# EasyEDA Pro project FFB6.1_EasyEDA_Pro_Document.epro

# Board PCB_Blimp_V6.0
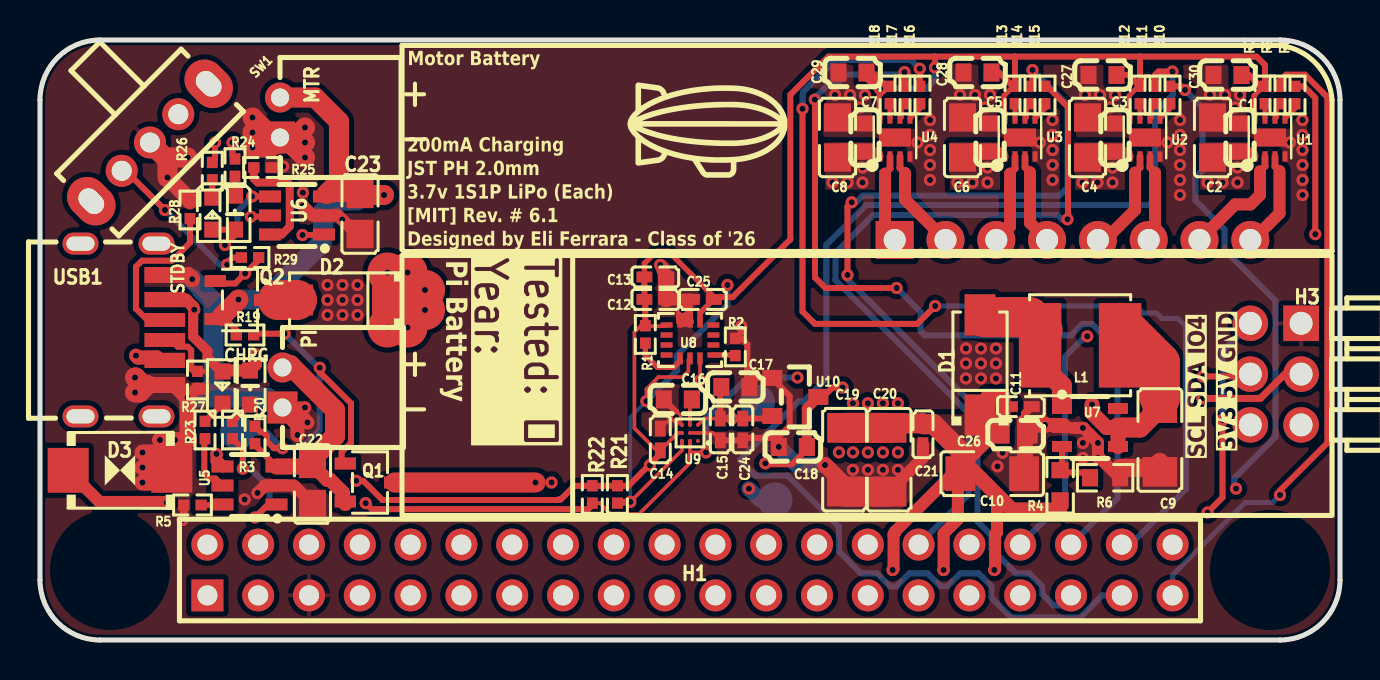
[diagram p0: board, top side]
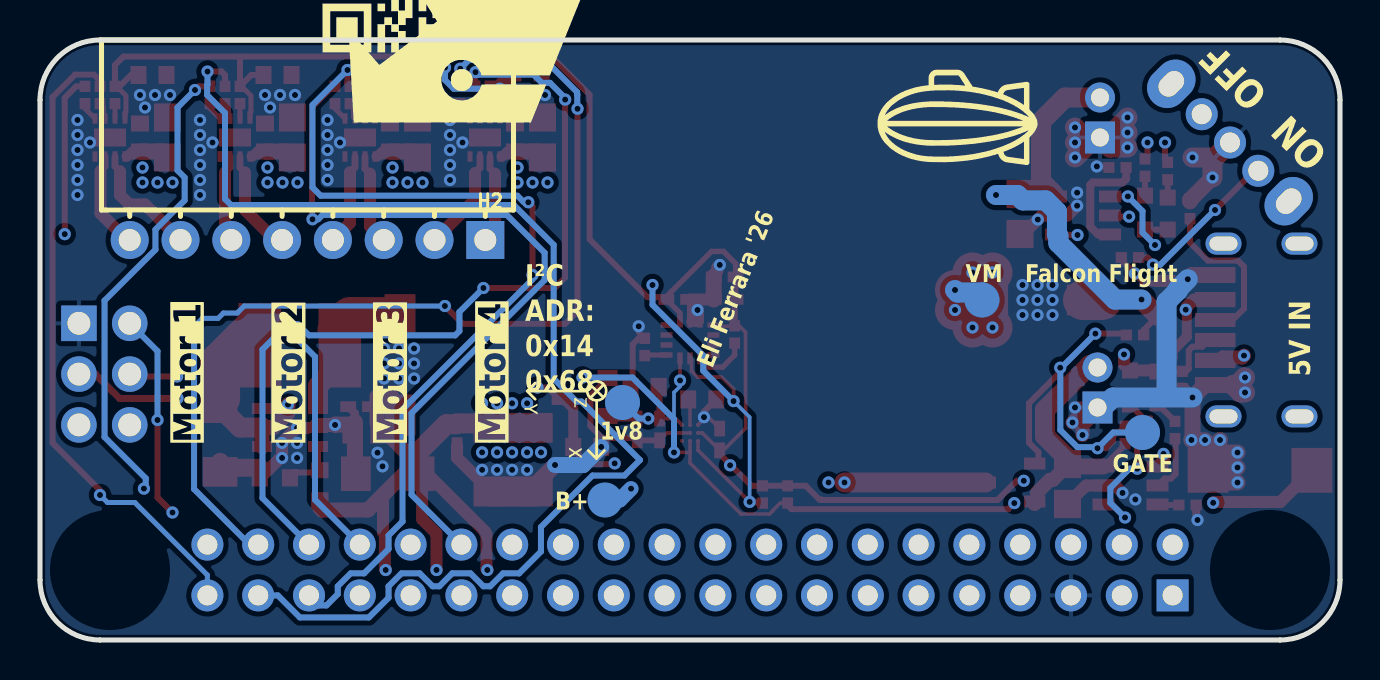
[diagram p1: board, bottom side, seen from below]

Outline 65 x 30 mm; copper layers: Top Layer, Inner1, Inner2, Bottom Layer. Coordinates in mm from the lower left corner of the outline.
Outline path: 0,27 arc(0.88,29.12) 3,30 62,30 arc(64.12,29.12) 65,27 65,3 arc(64.12,0.88) 62,0 3,0 arc(0.88,0.88) 0,3 0,27
Stack: Top Layer 0.035mm Outer layer thickness 1oz / Dielectric1 0.2104mm 7628 RC49% 8.6mil / Inner1 0.0152mm Inner layer thickness / Dielectric2 1.065mm 1.1mm H/HOZ Copper / Inner2 0.0152mm Inner layer thickness / Dielectric3 0.2104mm 7628 RC49% 8.6mil / Bottom Layer 0.035mm Outer layer thickness 1oz

## Design rules (mm)
template: User Custom Config
spacing Default (default): track to track 0.152, other pairs 0 to 0.152
track width Default (default): min 0.2, default 0.25, max 25.4
track width DriverPWR: min 0.35, default 0.75, max 1
track width MotorPWR: min 0.2, default 0.6, max 0.8
differential pair differentialPair (default): width min 0.127, default 0.254, max 2.54; gap min 0.152, default 0.152
via Default (default): diameter min 0.61, default 0.61, max 100.025; hole min 0.305, default 0.305, max 59.995
net 5V uses DriverPWR
net GND uses DirectConnect
net V_MOTOR uses DirectConnect

## Placement (name value [footprint] x y rotation side)
C1  100nF  [C0603]  60 25.12 270 top
C2  22uF  [C0805]  58.62 25.12 270 top
C3  100nF  [C0603]  53.75 25.12 270 top
C4  22uF  [C0805]  52.38 25.12 270 top
C5  100nF  [C0603]  47.5 25.12 270 top
C6  22uF  [C0805]  46.12 25.12 270 top
C7  100nF  [C0603]  41.25 25.12 270 top
C8  22uF  [C0805]  39.88 25.12 270 top
C9  22uF  [C1206]  55.99 10 90 top
C10  22uF  [C1206]  47.61 8.32 180 top
C11  100nF  [C0402]  49.04 11.67 180 top
C12  100nF  [C0402]  30.77 17.03 180 top
C13  100nF  [C0402]  30.77 18.15 180 top
C14  100nF  [C0402]  31.02 10.03 270 top
C15  100nF  [C0402]  34.02 10.53 270 top
C16  2.2uF  [C0603]  31.89 12.03 0 top
C17  2.2uF  [C0603]  34.77 12.65 0 top
C18  2.2uF  [C0603]  37.64 9.65 180 top
C19  100uF  [C1206]  40.23 9.02 270 top
C20  10uF  [C1206]  42.46 9.01 270 top
C21  100nF  [C0402]  44.15 10.29 270 top
C22  10uF  [C0805]  13.62 7.8 90 top
C23  10uF  [C0805]  16 21.3 90 top
C24  10uF  [C0402]  35.14 10.53 90 top
C25  10uF  [C0402]  33.14 17.03 0 top
C26  1uF  [C0603]  48.78 10.27 180 top
C27  100nF  [C0603]  53.12 28.25 180 top
C28  100nF  [C0603]  46.88 28.38 180 top
C29  100nF  [C0603]  40.62 28.38 180 top
C30  100nF  [C0603]  59.38 28.25 180 top
CHRG  RED_0603  [LED0603-R-RD]  10.5 12.62 90 top
CHRG1  RED_0603  [LED0603-R-RD]  9.75 21.37 270 top
D1  SS54  [SMA_L4.4-W2.8-LS5.4-R-RD]  47 13.75 90 top
D2  SS54  [SMA_L4.4-W2.8-LS5.4-R-RD]  15.12 17 180 top
D3  P6SMB6.8CA/TR13  [SMB_L4.6-W3.6-LS5.3-BI]  4 8.48 0 top
H1  Pi Zero Header  [HDR-TH_40P-P2.54-V-F-R2-C20-S2.54]  32.5 3.5 0 top
H2  PM254-1-08-W-8.5  [HDR-TH_8P-P2.54-H-F-W10.0-N]  51.62 20 0 bottom
H3  A2541WR-2x3P  [HDR-TH_6P-P2.54-H-R2-C3-S2.54-W10.0_A2541WR]  61.78 13.3 270 top
L1  6.8uH  [IND-SMD_L5.0-W5.0]  52.01 14.74 0 top
MTR  Battery Connector  [HDR-TH_2P-P2.00-H-F-W6.0]  12 26.12 90 top
NOREF  -  [Pad_e969]  35.88 11.88 0 top
NOREF#2  -  [Pad_e1825]  9.88 10.38 0 top
NOREF#3  -  [Pad_e638]  36.75 7 0 top
NOREF#4  -  [Pad_e3380]  17.9 17 0 top
PI  Battery Connector  [HDR-TH_2P-P2.00-H-F-W6.0]  12.12 12.62 90 top
Q1  DMP2035U-7  [SOT-23-3_L2.9-W1.6-P1.90-LS2.8-BR]  16.5 7.88 180 top
Q2  DMP2035U-7  [SOT-23-3_L2.9-W1.6-P1.90-LS2.8-BR]  10 17 180 top
R1  100kΩ  [R0402]  30.27 15.28 90 top
R2  100kΩ  [R0402]  34.77 14.65 270 top
R3  1kΩ  [R0402]  9.62 10.5 90 top
R4  220kΩ  [R0603]  51.01 7.74 270 top
R5  5.1kΩ  [R0402]  7.62 6.75 180 top
R6  30kΩ  [R0603]  53.26 8.11 180 top
R7  330Ω  [R0402]  62.75 27.25 90 top
R8  330Ω  [R0402]  62 27.25 270 top
R9  10kΩ  [R0402]  61.25 27.25 270 top
R10  330Ω  [R0402]  56.5 27.25 90 top
R11  330Ω  [R0402]  55.75 27.25 270 top
R12  10kΩ  [R0402]  55 27.25 270 top
R13  330Ω  [R0402]  50.25 27.25 90 top
R14  330Ω  [R0402]  49.5 27.25 270 top
R15  10kΩ  [R0402]  48.75 27.25 270 top
R16  330Ω  [R0402]  44 27.25 90 top
R17  330Ω  [R0402]  43.25 27.25 270 top
R18  10kΩ  [R0402]  42.5 27.25 270 top
R19  100kΩ  [R0402]  10.25 15.25 0 top
R20  100kΩ  [R0402]  10.75 10.25 270 top
R21  2.2kΩ  [R0402]  28.87 7.28 90 top
R22  2.2kΩ  [R0402]  27.62 7.28 90 top
R23  10kΩ  [R0402]  8.25 10.5 90 top
R24  1kΩ  [R0402]  9.75 23.62 270 top
R25  5.1kΩ  [R0402]  11.12 23.62 0 top
R26  10kΩ  [R0402]  8.61 23.44 270 top
R27  5.1kΩ  [R0402]  7.88 13 90 top
R28  5.1kΩ  [R0402]  7.5 21.5 270 top
R29  100Ω  [R0402]  10.5 19.12 0 top
STDBY  NCD0603G3  [LED0603-RD]  9.12 12.62 90 top
STDBY1  NCD0603G3  [LED0603-RD]  8.61 21.32 270 top
SW1  SK12D07VG3  [SW-TH_SK12D07VG3]  5.5 24.88 225 top
U1  DRV8212PDSGR  [WSON-8_L2.0-W2.0-P0.50-TL-EP]  61.5 25.12 90 top
U2  DRV8212PDSGR  [WSON-8_L2.0-W2.0-P0.50-TL-EP]  55.25 25.12 90 top
U3  DRV8212PDSGR  [WSON-8_L2.0-W2.0-P0.50-TL-EP]  49 25.12 90 top
U4  DRV8212PDSGR  [WSON-8_L2.0-W2.0-P0.50-TL-EP]  42.75 25.12 90 top
U5  TP4057  [SOT-23-6_L2.9-W1.6-P0.95-LS2.8-BR]  10.47 7.73 0 top
U6  TP4057  [SOT-23-6_L2.9-W1.6-P0.95-LS2.8-BR]  12.85 21.23 0 top
U7  MT3608  [SOT-23-6_L2.9-W1.6-P0.95-LS2.8-BR#2]  52.5 10.62 180 top
U8  BMI270  [LGA-14_L3.0-W2.5-P0.50-BR]  32.5 15 0 top
U9  BMM350  [WLCSP-9_L1.3-W1.3-R3-C3-P0.40-TL]  32.5 10.35 180 top
U10  ME6206A18XG  [SOT-23_L2.9-W1.3-P1.90-LS2.4-BR]  37.77 12.15 180 top
USB1  USB-TYPE-C-6PIN  [USB-C-SMD-6P]  4 15.5 0 top

## Footprints (pads in the part's own frame, mm; a bottom-side part is the same pattern mirrored in y, then rotated)
C0402
  rect 0.79x0.54 smd: 1(-0.545,0) 2(0.545,0)
C0603
  rect 0.8x0.9 smd: 1(-0.7,0) 2(0.7,0)
C0805
  rect 1.41x1.35 smd: 1(-1,0) 2(1,0)
C1206
  rect 1.485x1.728 smd: 1(-1.593,0) 2(1.593,0)
HDR-TH_2P-P2.00-H-F-W6.0
  rect 1.6x1.5 hole 0.9: 1(-1,0)
  round 1.5 hole 0.9: 2(1,0)
HDR-TH_6P-P2.54-H-R2-C3-S2.54-W10.0_A2541WR
  rect 1.778x1.778 hole 1.143: 1(-2.54,1.27)
  round 1.778 hole 1.143: 2(-2.54,-1.27) 3(0,1.27) 4(0,-1.27) 5(2.54,1.27) 6(2.54,-1.27)
HDR-TH_8P-P2.54-H-F-W10.0-N
  rect 1.9x1.9 hole 1.1: 1(-8.89,0)
  round 1.9 hole 1.1: 2(-6.35,0) 3(-3.81,0) 4(-1.27,0) 5(1.27,0) 6(3.81,0) 7(6.35,0) 8(8.89,0)
HDR-TH_40P-P2.54-V-F-R2-C20-S2.54
  rect 1.6x1.6 hole 1: 1(-24.13,-1.27)
  round 1.6 hole 1: 2(-24.13,1.27) 3(-21.59,-1.27) 4(-21.59,1.27) 5(-19.05,-1.27) 6(-19.05,1.27) 7(-16.51,-1.27) 8(-16.51,1.27) 9(-13.97,-1.27) 10(-13.97,1.27) 11(-11.43,-1.27) 12(-11.43,1.27) 13(-8.89,-1.27) 14(-8.89,1.27) 15(-6.35,-1.27) 16(-6.35,1.27) 17(-3.81,-1.27) 18(-3.81,1.27) 19(-1.27,-1.27) 20(-1.27,1.27) 21(1.27,-1.27) 22(1.27,1.27) 23(3.81,-1.27) 24(3.81,1.27) 25(6.35,-1.27) 26(6.35,1.27) 27(8.89,-1.27) 28(8.89,1.27) 29(11.43,-1.27) 30(11.43,1.27) 31(13.97,-1.27) 32(13.97,1.27) 33(16.51,-1.27) 34(16.51,1.27) 35(19.05,-1.27) 36(19.05,1.27) 37(21.59,-1.27) 38(21.59,1.27) 39(24.13,-1.27) 40(24.13,1.27)
IND-SMD_L5.0-W5.0
  rect 2.124x4.22 smd: 1(2,0) 2(-2,0)
LED0603-R-RD
  rect 0.8x0.8 smd: 1(0.851,0) 2(-0.851,0)
LED0603-RD
  rect 0.8x0.8 smd: 1(-0.799,0) 2(0.799,0)
LGA-14_L3.0-W2.5-P0.50-BR
  rect 0.6x0.27 smd: 1(1.17,-0.75) 2(1.17,-0.25) 3(1.17,0.25) 4(1.17,0.75) 8(-1.17,0.75) 9(-1.17,0.25) 10(-1.17,-0.25) 11(-1.17,-0.75)
  rect 0.27x0.6 smd: 5(0.5,0.92) 6(0,0.92) 7(-0.5,0.92) 12(-0.5,-0.92) 13(0,-0.92) 14(0.5,-0.92)
Pad_e638
  round 1.75 smd far side: TP1(0,0)
Pad_e969
  round 1.75 smd far side: TP1(0,0)
Pad_e1825
  round 1.75 smd far side: TP1(0,0)
Pad_e3380
  round 1.75 smd far side: TP1(0,0)
R0402
  rect 0.566x0.54 smd: 1(-0.433,0) 2(0.433,0)
R0603
  rect 0.806x0.864 smd: 1(-0.753,0) 2(0.753,0)
SMA_L4.4-W2.8-LS5.4-R-RD
  rect 2.062x1.539 smd: 1(2.503,0) 2(-2.503,0)
SMB_L4.6-W3.6-LS5.3-BI
  rect 2.047x2.241 smd: 1(-2.591,0) 2(2.591,0)
SOT-23-3_L2.9-W1.6-P1.90-LS2.8-BR
  rect 1.07x0.6 smd: 1(1.235,-0.95) 2(1.235,0.95) 3(-1.235,0)
SOT-23-6_L2.9-W1.6-P0.95-LS2.8-BR
  rect 1.1x0.6 smd: 1(1.35,-0.95) 2(1.35,0) 3(1.35,0.95) 4(-1.35,0.95) 5(-1.35,0) 6(-1.35,-0.95)
SOT-23-6_L2.9-W1.6-P0.95-LS2.8-BR#2
  rect 1x0.55 smd: 1(1.4,-0.95) 2(1.4,0) 3(1.4,0.95) 4(-1.4,0.95) 5(-1.4,0) 6(-1.4,-0.95)
SOT-23_L2.9-W1.3-P1.90-LS2.4-BR
  rect 1x0.8 smd: 1(1.15,-0.95) 2(1.15,0.95) 3(-1.15,0)
SW-TH_SK12D07VG3
  oval 1.6x1.6 hole 1: 1(-2,0) 2(0,0) 3(2,0)
  oval 2x2.6 hole 1x1.4: 4(4.15,0) 5(-4.15,0)
USB-C-SMD-6P
  oval 1.8x1.1 hole 1.401x0.7: 0(-1.975,4.32) 0(-1.975,-4.32) 0(1.825,4.32) 0(1.825,-4.32)
  rect 2.032x0.8 smd: 1(2.241,2.749) 6(2.241,-2.749)
  rect 2.032x0.76 smd: 2(2.241,1.52) 5(2.241,-1.52)
  rect 2.032x0.7 smd: 3(2.241,0.5) 4(2.241,-0.5)
WLCSP-9_L1.3-W1.3-R3-C3-P0.40-TL
  round 0.2 smd: A1(-0.4,0.4) A2(0,0.4) A3(0.4,0.4) B1(-0.4,0) B2(0,0) B3(0.4,0) C1(-0.4,-0.4) C2(0,-0.4) C3(0.4,-0.4)
WSON-8_L2.0-W2.0-P0.50-TL-EP
  rect 0.521x0.25 smd: 1(-0.95,0.75) 2(-0.95,0.25) 3(-0.95,-0.25) 4(-0.95,-0.75) 5(0.95,-0.75) 6(0.95,-0.25) 7(0.95,0.25) 8(0.95,0.75)
  rect 0.9x1.6 smd: 9(0,0)

## Nets
1.8V: C15.1 C17.1 C24.2 NOREF.TP1 U9.C1 U10.2
5V: C10.2 C11.2 C19.1 C20.1 C21.1 C26.2 D1.2 H1.1 H3.3 R4.2
GND: C1.1 C2.1 C3.1 C4.1 C5.1 C6.1 C7.1 C8.1 C9.1 C10.1 C11.1 C12.1 C13.1 C14.1 C15.2 C16.1 C17.2 C18.2 C19.2 C20.2 C21.2 C22.1 C23.1 C24.1 C25.1 C26.1 C27.2 C28.2 C29.2 C30.2 D3.2 H1.5 H3.1 MTR.1 PI.1 R2.1 R5.2 R6.1 R25.2 R27.1 R28.1 SW1.2 U1.4 U1.9 U2.4 U2.9 U3.4 U3.9 U4.4 U4.9 U5.2 U6.2 U7.2 U8.6 U8.7 U9.B1 U9.B2 U9.C3 U10.1 USB1.1 USB1.6
VBUS: CHRG.1 CHRG1.1 D3.1 STDBY.2 STDBY1.2 U5.4 U6.4 USB1.2 USB1.5
1WIRE: H1.8 H3.2
BOOST_IN: C9.2 L1.1 NOREF#3.TP1 Q1.3 U7.4 U7.5
MOTOR1_INPUT0: H1.39 R8.1
MOTOR1_INPUT1: H1.34 R7.2
MOTOR1_PIN0: H2.7 U1.2
MOTOR1_PIN1: H2.8 U1.3
MOTOR2_INPUT0: H1.37 R11.1
MOTOR2_INPUT1: H1.32 R10.2
MOTOR2_PIN0: H2.5 U2.2
MOTOR2_PIN1: H2.6 U2.3
MOTOR3_INPUT0: H1.35 R14.1
MOTOR3_INPUT1: H1.30 R13.2
MOTOR3_PIN0: H2.3 U3.2
MOTOR3_PIN1: H2.4 U3.3
MOTOR4_INPUT0: H1.36 R17.1
MOTOR4_INPUT1: H1.38 R16.2
MOTOR4_PIN0: H2.1 U4.2
MOTOR4_PIN1: H2.2 U4.3
MOTOR_BAT: C23.2 MTR.2 Q2.2 R19.1 U6.3
PI_3V3: C12.2 C13.2 C14.2 C18.1 C25.2 C27.1 C28.1 C29.1 C30.1 H1.2 H3.5 R1.2 R9.1 R12.1 R15.1 R18.1 R21.2 R22.2 U1.8 U2.8 U3.8 U4.8 U8.5 U8.8 U9.B3 U10.3
PI_5V: H1.3
PI_BAT: C22.2 PI.2 Q1.2 R20.2 U5.3
SCL: H1.6 H3.6 R21.1 U8.13 U9.A3
SDA: H1.4 H3.4 R22.1 U8.14 U9.A2
V_MOTOR: C1.2 C2.2 C3.2 C4.2 C5.2 C6.2 C7.2 C8.2 D2.2 NOREF#4.TP1 U1.1 U2.1 U3.1 U4.1
$1N60: R4.1 R6.2 U7.3
$1N63: D1.1 L1.2 U7.1
$1N17709: R1.1 U8.12
$1N17837: R2.2 U8.1
$1N18752: C16.2 U9.C2
$1N47192: R27.2 USB1.4
$1N47193: R28.2 USB1.3
$1N47226: R3.1 U5.1
$1N47230: CHRG.2 R3.2
$1N47298: R23.1 U5.5
$1N47344: R5.1 U5.6
$1N48185: R24.1 U6.1
$1N48187: R26.1 U6.5
$1N48202: R25.1 U6.6
$1N48204: CHRG1.2 R24.2
$1N52678: NOREF#2.TP1 Q1.1 Q2.1 R19.2 R20.1 R29.2
$1N67133: R26.2 STDBY1.1
$1N67173: R23.2 STDBY.1
$1N67180: D2.1 Q2.3
$1N86456: R29.1 SW1.3
$1N88956: R7.1 U1.5
$1N88998: R8.2 U1.6
$1N89483: R11.2 U2.6
$1N89485: R10.1 U2.5
$1N89803: R14.2 U3.6
$1N89805: R13.1 U3.5
$1N90123: R17.2 U4.6
$1N90125: R16.1 U4.5
$1N90197: R9.2 U1.7
$1N90243: R12.2 U2.7
$1N90285: R15.2 U3.7
$1N90327: R18.2 U4.7

Pads without a net: H1 7 9 10 11 12 13 14 15 16 17 18 19 20 21 22 23 24 25 26 27 28 29 31 33 40; SW1 1 4 5; U7 6; U8 2 3 4 9 10 11; U9 A1; USB1 0

## Via types
v1: diameter 0.61, hole 0.305, Top Layer to Bottom Layer, 199 vias

## Routing (per net, layer and track width the routed paths; a pad name or vN(x,y) marks a point on that pad's centre or on a via; arc(x,y) is an arc through that point)
1.8V: length 7.1
  Top Layer w0.181: 34.02,11.07 33.22,11.07 U9.C1
  Top Layer w0.3: C17.1 34.02,12.6 34.02,11.07 v1(34.59,11.07) 36.49,11.07 U10.2
  Bottom Layer w0.3: v1(34.59,11.07) 35.07,11.07 NOREF.TP1
5V: length 37.3
  Top Layer w0.35: H3.3 62.23,13.3 61.02,12.08 58.13,12.08 v1(58.12,12.09)
  Top Layer w0.6: v1(47.72,3.5) 47.76,3.54 47.76,5.29 47.85,5.38 47.85,7.26 ; 45.89,8.57 45.89,6.04 45.18,5.33 45.18,3.51 v1(45.18,3.5) ; 45.89,8.57 42.75,5.42 42.75,5.36 42.68,5.29 42.68,3.55 42.62,3.5 ; 45.89,8.57 45.89,8.69 46.02,8.82
  Top Layer w0.75: 48.15,10.84 48.15,12.17 47.4,12.17 ; 51.01,6.61 50.9,6.5 48.6,6.5 47.85,7.25 46.58,8.52 ; 48.08,10.77 46.58,9.27
  Top Layer w1: C20.1 42.68,10.83 C21.1 44.19,10.79 44.69,10.79 46.02,9.46
  Top Layer w1.5: C19.1 C20.1
  vias: v1(39.95,9.38) v1(40.65,11.84) v1(40.65,9.38) v1(41.4,11.84) v1(41.4,9.38) v1(42.15,11.84) v1(42.15,9.38) v1(42.63,3.5) v1(42.9,11.84) v1(42.9,9.38)
GND: length 90.4
  Top Layer w0.181: 31.02,10.57 31.59,11.14 v1(31.8,11.14) 31.8,11.05 U9.C3 ; C15.2 33.65,10.35 U9.B1 U9.B2
  Top Layer w0.27: U8.6 32.51,15.93 32.51,17.03 ; R2.1 35.07,15.39 v1(35.07,15.69)
  Top Layer w0.3: 35.47,12.89 35.68,13.1 36.58,13.1 ; 35.47,12.89 C17.2 ; 35.47,12.89 35.37,12.99 35.37,14.79 35.07,15.09 R2.1 ; 36.58,13.1 37.48,12.2 37.48,10.7 36.88,10.1 ; 36.58,13.1 U10.1 ; C16.1 31.8,11.42 v1(31.8,11.14) ; R25.2 11.54,23.62 11.49,23.68 v1(12.16,23.68) ; v1(36.94,9.65) 36.88,9.71 36.88,10.1 ; 36.88,10.1 35.26,10.1 C24.1 C15.2
  Top Layer w0.4: R5.2 7.19,6.07 v1(7.12,6) ; 49.25,10.9 49.25,11.33 C11.1 ; U8.6 U8.7 ; 12.5,24.88 12.25,25.12
  Top Layer w0.6: C21.2 44.15,9.11 C20.2 ; 8.12,12.57 7.82,12.57 v1(7.38,12.12) ; 51.62,10.6 v1(52.15,10.6) 52.18,10.6 52.9,9.88 52.9,9.19 53.87,8.22 ; v1(31.01,18.75) 31.14,18.63 31.14,18.45 31.31,18.28 31.31,18.15 ; C23.1 15.83,20.3 14.91,21.23 13.63,21.23 v1(13.14,21.71) ; 12.62,11.62 v1(13.25,11.62) ; v1(10.88,7.35) 11.25,7.73 U5.2 12.68,7.73 12.76,7.64 12.78,7.64 C22.1 ; 31.31,17.03 32.51,17.03
  Top Layer w0.7: v1(12.88,10.25) 12.88,10.75 12.15,11.47 ; v1(13.38,10.88) 12.62,11.62 ; 51.17,10.75 v1(50.25,10.75)
  Top Layer w0.8: 49.2,8.82 49.25,8.87 49.25,10.9 ; v1(7.61,18.04) 7.4,18.25 USB1.1 ; v1(39.25,8.75) 40.23,7.77 40.23,7.42 ; v1(5.12,7.88) 5.99,7.88 6.59,8.47 6.59,9.41 v1(6,10) ; 6.75,9.99 7.43,9.99 ; v1(5.12,8.62) 6.44,8.62 5.69,9.38 v1(5.12,9.38) ; R28.1 7.5,22 v1(6.38,23.12) ; 49.48,10.77 50.23,10.77 v1(50.25,10.75) ; 31.31,18.15 31.31,17.03 ; v1(7.43,10) 7.38,10.05 v1(7.38,12.12) 6.75,12.75 USB1.6 ; 32.2,16.5 32.2,16.05
  Top Layer w0.9: 54.01,8.61 55.7,8.61 55.99,8.91
  Top Layer w1: v1(13.25,24.88) 12.5,24.88 v1(13.25,24.12) ; MTR.1 11.5,24.62 v1(10.62,24.62) ; v1(4.75,12.38) 4.97,12.38 5.35,12.75 5.15,12.75 4.78,13.12 v1(4.75,13.12) ; v1(10.62,25.38) 11.38,25.38 v1(10.62,26.12) ; 6.25,24.12 SW1.2 ; 6.25,24.12 v1(7.38,24.12) ; 6.25,24.12 6.38,24 v1(6.38,23.12) ; v1(13.25,25.62) 12.75,25.12 12.25,25.12
  Top Layer w1.5: C20.2 40.23,7.42
  Bottom Layer w0.3: 12,11.62 12,11.48
  Bottom Layer w0.8: v1(39.25,8.75) 37.84,8.75 v1(36.94,9.65)
  Bottom Layer w1: 12,11.48 11.35,12.12 v1(7.38,12.12) ; v1(7.61,18.04) 8.11,17.54 8.11,17.47 8.67,16.91 8.67,12.2
  vias: v1(6.75,10) v1(10.23,7.03) v1(13.14,22.37) v1(14.38,17.75) v1(14.38,17) v1(14.38,16.25) v1(15.11,21.02) v1(15.12,17.75) v1(15.12,17) v1(15.12,16.25) v1(15.88,17.75) v1(15.88,17) v1(15.88,16.25) v1(32.12,16.5) v1(39.75,27.25) v1(40.5,27.25) v1(40.65,8.51) v1(41,26.62) v1(41.25,27.25) v1(41.4,8.51) v1(42.15,8.51) v1(42.9,8.51) v1(43.88,24.88) v1(44.5,26) v1(44.5,25.25) v1(44.5,24.5) v1(44.5,23.75) v1(44.5,23) v1(46,27.25) v1(46.3,14.58) v1(46.3,13.83) v1(46.3,13.08) v1(46.75,27.25) v1(47.05,14.58) v1(47.05,13.83) v1(47.05,13.08) v1(47.25,26.62) v1(47.5,27.25) v1(47.8,14.58) v1(47.8,13.83) v1(47.8,13.08) v1(47.88,8.68) v1(48.12,9.36) v1(50,24.88) v1(50.62,26) v1(50.62,25.25) v1(50.62,24.5) v1(50.62,23.75) v1(50.62,23) v1(52.15,9.85) v1(52.15,9.1) v1(52.25,27.25) v1(52.9,9.85) v1(52.9,9.1) v1(53,27.25) v1(53.5,26.62) v1(53.75,27.25) v1(56.38,24.88) v1(57,26) v1(57,25.25) v1(57,24.5) v1(57,23.75) v1(57,23) v1(57,22.25) v1(58.5,27.25) v1(59.25,27.25) v1(59.75,26.62) v1(60,27.25) v1(62.5,24.88) v1(63.12,26) v1(63.12,25.25) v1(63.12,24.5) v1(63.12,23.75) v1(63.12,23) v1(63.12,22.25)
VBUS: length 39.9
  Top Layer w0.3: STDBY1.2 9.75,20.52 CHRG1.1 9.75,20.25 v1(9.25,19.75) ; v1(10.61,22.18) 11.5,22.18 U6.4
  Top Layer w0.5: 7.66,16.57 7.66,16.62 ; 7.66,16.57 7.66,15.17 8.38,14.45 8.38,14.11 9.06,13.42 STDBY.2 ; 7.66,16.57 v1(7.71,16.52)
  Top Layer w0.6: U5.4 8.82,8.98 v1(8.82,9.3) ; v1(6.34,6.86) 6.3,6.9 2.98,6.9 1.41,8.47 ; STDBY.2 9.18,13.48 CHRG.1 10.8,13.78 v1(10.8,14.28) ; 7.66,16.62 7.66,16.66 7.3,17.02 USB1.2
  Top Layer w0.7: 5.88,14.1 5.84,14.13 4.89,14.13 v1(4.8,14.22)
  Inner2 w0.4: v1(7.71,16.52) 8.5,17.3 8.5,17.38 8.7,17.58 8.7,19.2 v1(9.25,19.75)
  Inner2 w0.9: v1(10.8,14.28) 10.5,13.98 9,13.98
  Inner2 w1: v1(4.8,14.22) 8.76,14.22 9.3,13.68 9.3,9.78 v1(8.82,9.3) 8.79,9.3 v1(6.34,6.86)
  Bottom Layer w0.3: v1(10.61,22.18) 9.88,21.45 9.88,20.38 v1(9.25,19.75)
1WIRE: length 57.6
  Top Layer w0.3: v1(59.12,11) 59.12,7.12 v1(58.38,6.38)
  Inner2 w0.35: H1.8 16.94,4.77 18.06,3.64 19,3.64 19.94,4.59 19.94,5.24 20.6,5.9 44.85,5.9 45.34,5.41 45.34,4.3 46,3.64 46.94,3.64 47.6,4.3 47.6,4.95 49.02,6.38 v1(58.38,6.38)
  Bottom Layer w0.3: H3.2 59.12,14.44 v1(59.12,11)
BOOST_IN: length 49.4
  Top Layer w0.75: U7.4 U7.5 53.33,10.62 52.6,11.36 v1(52.6,11.77)
  Top Layer w1: v1(24.78,7.88) Q1.3 ; 55.99,11.62 55,10.62 U7.5
  Top Layer w2: 55.99,12.09 55.99,13.87 54.01,15.86
  Inner2 w1: 30.13,7.65 30.21,7.57 v1(35.45,7.57) 40.23,7.57 40.25,7.55 43.29,7.55 43.31,7.57 48.4,7.57 49.29,8.45 49.29,11.15 49.85,11.71 50.64,11.71 50.65,11.7 52.53,11.7 ; 29.98,7.8 29.9,7.88 v1(25.57,7.88) v1(24.78,7.88)
  Bottom Layer w0.75: 36.5,7 36.01,7 v1(35.45,7.57)
MOTOR1_INPUT0: length 32.2
  Top Layer w0.3: v1(62,7.25) 62,7.48 64.37,9.85 64.37,27.14 63.25,28.27 62.3,28.27 62,27.97 R8.1
  Bottom Layer w0.25: v1(62,7.25) 61.62,6.88 60.26,6.88 56.63,3.25 H1.39
MOTOR1_INPUT1: length 34.3
  Top Layer w0.3: v1(63.76,20.29) 63.76,27.11 63.19,27.68 R7.2
  Inner2 w0.3: v1(63.76,20.29) 61.97,18.5 54.17,18.5 52.64,16.97 52.64,15.46 v1(52.36,15.18)
  Bottom Layer w0.3: H1.34 51.25,7.01 51.25,14.17 52.27,15.18 v1(52.36,15.18)
MOTOR1_PIN0: length 6
  Top Layer w0.345: 61,23.44 61.25,23.69 61.25,24.17
  Top Layer w0.6: 61,23.44 61,22.25 60.53,21.78 59.75,21.78 H2.7
MOTOR1_PIN1: length 4.9
  Top Layer w0.345: 61.97,23.45 61.75,23.68 U1.3
  Top Layer w0.6: H2.8 60.64,20 61.97,21.33 61.97,23.45
MOTOR2_INPUT0: length 63.3
  Top Layer w0.3: R11.1 55.75,28.25 55.92,28.42 v1(56.62,28.42)
  Bottom Layer w0.3: v1(56.62,28.42) 56.62,27.77 56.64,27.75 56.64,27.25 55.75,26.36 55.75,22.05 55.45,21.75 41.31,21.75 39.32,19.76 39.32,13.07 38.17,11.92 37.93,11.92 35,9 35.77,8.22 37.38,8.22 39.95,5.65 39.95,4.42 41.04,3.33 41.85,3.33 42.49,2.69 42.83,2.69 43.47,3.33 44.39,3.33 45.03,2.69 45.37,2.69 46.01,3.33 46.93,3.33 47.57,2.69 47.57,2.11 48.55,1.13 52.01,1.13 53.11,2.23 H1.37
MOTOR2_INPUT1: length 38.9
  Top Layer w0.3: v1(57.25,27.5) 57.07,27.68 R10.2
  Inner2 w0.3: H1.32 46.74,4.77 50.29,8.32 59.05,8.32 v1(59.8,7.57)
  Bottom Layer w0.3: v1(59.8,7.57) 59.71,7.66 59.71,8.09 61.77,10.15 61.77,16.97 59.23,19.52 59.23,20.52 57.77,21.98 57.77,23.13 58.12,23.48 58.12,26.62 v1(57.25,27.5)
MOTOR2_PIN0: length 5.3
  Top Layer w0.345: U2.2 55,23.62 54.75,23.38
  Top Layer w0.6: H2.5 53.25,20 54.75,21.5 54.75,23.38
MOTOR2_PIN1: length 4.4
  Top Layer w0.345: U2.3 55.5,23.62 55.75,23.38
  Top Layer w0.6: 55.75,23.38 55.75,20.31 H2.6
MOTOR3_INPUT0: length 44.6
  Top Layer w0.3: v1(49.62,28.5) 49.62,27.81 R14.1 ; v1(40.38,18.25) 40.38,21.68 v1(40.59,21.89)
  Bottom Layer w0.3: H1.35 51.05,1.73 50.68,1.73 50.11,2.29 50.11,2.69 49.47,3.33 48.79,3.33 47.57,4.55 47.57,5.23 46.88,5.92 46.88,11.53 40.38,18.03 v1(40.38,18.25) ; v1(40.59,21.89) 40.8,21.89 41.13,22.22 50.97,22.22 51.38,22.62 51.38,26.75 v1(49.62,28.5)
MOTOR3_INPUT1: length 38.1
  Top Layer w0.3: R13.2 50.36,27.68 51.4,26.65 51.4,21.06 v1(51.38,21.04)
  Bottom Layer w0.3: H1.30 46.42,7.26 46.42,11.34 39.77,18 39.77,19.36 41.66,21.25 50.87,21.25 51.09,21.04 v1(51.38,21.04)
MOTOR3_PIN0: length 4.6
  Top Layer w0.345: 48.5,23.32 48.75,23.57 U3.2
  Top Layer w0.6: 48.5,23.32 48.5,20.69 H2.3
MOTOR3_PIN1: length 4.6
  Top Layer w0.345: U3.3 49.25,23.64 49.5,23.39
  Top Layer w0.6: 49.5,23.39 49.5,20.86 H2.4
MOTOR4_INPUT0: length 43.3
  Top Layer w0.3: v1(38.74,27.02) 38.74,27.1 38.75,27.11 38.75,18.12 39.27,17.6 v1(42.83,17.6) ; v1(43.23,28.39) 43.25,28.37 R17.1
  Bottom Layer w0.3: v1(42.83,17.6) 44.03,16.4 44.03,15.44 44.24,15.23 51.55,15.23 52.11,15.79 52.61,15.79 53.88,14.53 53.88,7.09 H1.36 ; v1(43.23,28.39) 43.1,28.27 40.32,28.27 39.91,27.86 39.5,27.86 38.74,27.1 v1(38.74,27.02)
MOTOR4_INPUT1: length 51.3
  Top Layer w0.3: v1(44.76,16.7) 43.86,15.81 38.75,15.81 38.12,16.43 38.12,26.56 ; R16.2 44,28.55 v1(43.99,28.56)
  Bottom Layer w0.25: 57.3,15.67 56.88,16.08 56.09,16.08 55.83,16.35 55.14,16.35 54.79,16.7 v1(44.76,16.7)
  Bottom Layer w0.3: 57.3,15.67 57.3,7.55 54.52,4.77 H1.38 ; v1(43.99,28.56) 43.55,29 39.75,29 38.14,27.39 38.14,27.28 38.14,27.27 38.14,26.77 38.12,26.76 v1(38.12,26.56)
MOTOR4_PIN0: length 4.5
  Top Layer w0.345: U4.2 42.5,23.57 42.25,23.32
  Top Layer w0.6: H2.1 42.25,20.48 42.25,23.32
MOTOR4_PIN1: length 5.1
  Top Layer w0.345: U4.3 43,23.6 43.25,23.35
  Top Layer w0.6: 43.25,23.35 43.25,22.03 H2.2
MOTOR_BAT: length 23.2
  Top Layer w0.3: R19.1 9.82,15.5 9.26,16.05 Q2.2
  Top Layer w0.8: C23.2 14.32,22.3
  Top Layer w1: MTR.2 13.75,27.12 14.95,25.93 14.95,22.92 14.32,22.3 ; C23.2 16.05,22.25 v1(17.2,22.25) ; 9.11,16.21 v1(9.92,17.02)
  Bottom Layer w1: v1(9.92,17.02) 11.25,17.02 14.08,19.85 14.08,20.21 14.15,20.28 14.15,21.42 14.71,21.98 15.85,21.98 16.12,22.25 v1(17.2,22.25)
PI_3V3: length 140.6
  Top Layer w0.181: U9.B3 31.89,10.35 C14.2 ; 30.92,9.39 29.72,10.59 29.72,15.39 30.02,15.69 31.27,15.69 U8.8 ; 30.5,8.79 v1(30.5,8.74)
  Top Layer w0.25: U3.8 48.25,26.37 48.2,26.42 48.2,27.22 48.67,27.68 ; 61.17,27.68 60.7,27.22 60.7,26.42 60.75,26.37 U1.8 ; 42.18,27.45 41.95,27.21 41.95,26.42 42,26.37 U4.8 ; U2.8 54.5,26.37 54.45,26.42 54.45,27.22 54.92,27.68 R12.1
  Top Layer w0.27: 30.32,15.69 R1.2 ; U8.5 33,16.35 33.68,17.03 C25.2 33.69,17.16 31.42,19.43 30.82,19.43 30.22,18.83 C13.2
  Top Layer w0.3: R1.2 30.27,16.98 C12.2 C13.2 ; C25.2 33.8,17.14 34.63,17.14 37.52,20.03 37.52,27.27 39.42,29.17 44.74,29.17 ; v1(40.12,12.62) 39.62,12.62 39.12,12.12 ; C28.1 47.95,28.38 48.64,27.68 R15.1 48.75,29.16 48.74,29.17 ; v1(36.27,8.83) 36.28,8.83 36.32,8.79 37.6,8.79 38.34,9.53 C18.1 ; 44.74,29.17 48.74,29.17 ; 44.74,29.17 44.75,29.16 v1(44.75,28.62) ; 48.74,29.17 55.01,29.17 ; 55.01,29.17 55,29.17 R12.1 54.43,28.25 C27.1 ; 55.01,29.17 60.83,29.17 61.25,28.75 R9.1 61.02,27.68 60.45,28.25 C30.1 ; C14.2 30.92,9.39 30.92,9.21 29.42,7.71 26.72,7.71 26.03,7.02 25.92,7.02 25.9,7 17.12,7 16.16,7.96 v1(15.81,7.96) ; 42.18,27.45 42.06,27.57
  Top Layer w0.5: U10.3 38.34,11.58 C18.1
  Top Layer w0.7: 42.01,27.63 42.01,27.69 C29.1
  Inner2 w0.3: H1.2 8.37,6.62 9.71,7.96 v1(15.81,7.96) ; H3.5 62.2,10.75 61.01,9.56 55.8,9.56 52.85,12.51 49.12,12.51 48.86,12.25 43.46,12.25 43.2,12.51 40.24,12.51 v1(40.12,12.62) ; v1(30.5,8.74) 36,8.74 36.09,8.83 v1(36.27,8.83)
  Bottom Layer w0.3: v1(44.75,28.62) 44.75,28 44.32,27.57 v1(42.01,27.57)
PI_BAT: length 13.1
  Top Layer w0.3: C22.2 13.47,8.8 ; R20.2 10.75,9.75 U5.3
  Top Layer w0.7: 15.26,6.8 15.14,6.92 15.14,7.38 14.51,8.01 14.36,8.01 13.62,8.74 C22.2
  Top Layer w0.8: 13.35,8.8 13.23,8.68 U5.3
  Top Layer w1: 12,13.62 12.12,13.75 12.5,13.75 14.75,11.5 14.75,10.2 13.35,8.8
SCL: length 67.8
  Top Layer w0.181: v1(29.52,6.91) 32.1,9.49 U9.A3 ; v1(30.32,11.94) 30.32,12.55 30.92,13.14 32.12,13.14 32.42,13.44 32.42,14 U8.13
  Top Layer w0.3: 29.12,6.84 29.18,6.91 v1(29.52,6.91)
  Inner2 w0.3: H1.6 14.92,6.24 18.24,6.24 18.91,6.91 v1(29.52,6.91) ; H3.6 60.51,11.11 59,12.62 59,13.49 58.03,14.45 52.24,14.45 50.69,16 37.51,16 35.91,17.61 34.52,17.61 v1(34.38,17.75)
  Bottom Layer w0.181: v1(30.32,11.94) 29.52,11.14 v1(29.52,6.91)
  Bottom Layer w0.3: v1(34.38,17.75) 34.38,16.76 31.84,14.22 31.84,13.46 v1(30.32,11.94)
SDA: length 60.7
  Top Layer w0.181: 32.5,9.38 v1(33.3,9.38) ; 32.5,9.38 32.5,8.85 29.95,6.3 28.52,6.3 28.36,6.46 28.36,6.48 27.99,6.84 27.87,6.84 ; 32.5,9.38 U9.A2 ; v1(33,12.98) U8.14
  Top Layer w0.3: 27.72,6.84 27.42,6.55 16.59,6.55 v1(16.29,6.84) ; v1(58.14,13.18) 60,13.18 60.19,13.37 60.27,13.3 H3.4
  Inner2 w0.3: H1.4 12.99,6.84 v1(16.29,6.84) ; v1(58.14,13.18) 57.32,14 51.88,14 50.33,15.55 40.3,15.55 v1(37.88,13.12)
  Bottom Layer w0.181: 33.3,11.05 33.3,12.38 33,12.68 v1(33,12.98)
  Bottom Layer w0.3: v1(33.3,9.38) 33.3,11.05 35.38,13.12 v1(37.88,13.12)
V_MOTOR: length 15.5
  Top Layer w0.5: 41.93,24.17 41.88,24.17 41.63,24.42 C7.2 ; 48.18,24.17 48.13,24.17 47.88,24.42 C5.2 ; 54.43,24.17 54.38,24.17 54.13,24.42 C3.2 ; 60.68,24.17 60.63,24.17 60.38,24.42 C1.2
  Top Layer w0.8: C1.2 58.93,24.42 C2.2 ; C8.2 40.18,24.42 C7.2 ; C4.2 52.68,24.42 C3.2 ; C6.2 46.43,24.42 C5.2
  Top Layer w2: 18.19,17 18.75,17 v1(19.25,17.5) ; v1(19.25,16.5) 19,16.75 19,16.88 ; 17.94,16.19 v1(17.38,15.62) ; v1(18.38,18.38) 17.94,17.94 17.94,17.81 v1(17.38,18.38) ; 18.07,15.93 v1(18.38,15.62)
  Bottom Layer w1: v1(19.25,17.5) 19.12,17.38 17.88,17.38 17.88,17.03 NOREF#4.TP1
  vias: v1(39.62,22.88) v1(40.38,22.88) v1(41.12,23.62) v1(41.12,22.88) v1(45.88,22.88) v1(46.62,22.88) v1(47.38,23.62) v1(47.38,22.88) v1(52.12,22.88) v1(52.88,22.88) v1(53.62,23.62) v1(53.62,22.88) v1(58.38,22.88) v1(59.12,22.88) v1(59.88,23.62) v1(59.88,22.88)
$1N60: length 2.7
  Top Layer w0.3: 51.1,9.8 51.1,8.71 51.01,8.61 51.01,8.38 52.26,8.38
$1N63: length 6.9
  Top Layer w1: 50.51,15.36 50.51,13.29 51.1,12.7 51.1,11.88
  Top Layer w2: 50.13,15.49 49.48,16.14 47.24,16.14
$1N17709: length 2.8
  Top Layer w0.27: U8.12 32,13.94 31.7,13.64 30.87,13.64 30.27,14.25 R1.1
$1N17837: length 1.1
  Top Layer w0.27: U8.1 34.74,14.25 R2.2
$1N18752: length 1.3
  Top Layer w0.181: U9.C2 32.5,11.94 32.59,12.03
$1N47192: length 3.1
  Top Layer w0.3: 8.12,13.43 7.69,13.43 7.56,13.57 7.56,14.48 7.38,14.66 6.9,14.66 6.56,15 USB1.4
$1N47193: length 8.2
  Top Layer w0.3: USB1.3 5.37,16 4.8,16.57 4.8,18.67 5.1,18.97 6.6,18.97 7.5,19.87 R28.2
$1N47226: length 6.6
  Top Layer w0.3: R3.1 10.14,9.55 v1(10.14,8.57) ; v1(10.75,6.12) 11.4,6.78 U5.1
  Bottom Layer w0.3: v1(10.75,6.12) 11.48,6.86 11.48,7.61 10.52,8.57 v1(10.14,8.57)
$1N47230: length 1.2
  Top Layer w0.3: R3.2 9.66,10.93 CHRG.2
$1N47298: length 2.9
  Top Layer w0.3: U5.5 8.78,8.07 8.45,8.07 8.22,8.31 8.22,10.03 R23.1
$1N47344: length 1.2
  Top Layer w0.3: U5.6 9.1,6.75 7.93,6.75
$1N48185: length 8
  Top Layer w0.3: 9.75,24.12 9.62,24.25 v1(9.62,24.88) ; v1(13.12,20.25) 14.17,20.25 14.2,20.28
  Inner2 w0.3: v1(13.12,20.25) 13.12,20.62 9.62,24.12 v1(9.62,24.88)
$1N48187: length 6.5
  Top Layer w0.3: U6.5 11.44,21.17 v1(10.54,21.17) ; v1(8.75,24.88) 8.75,24 8.62,23.88
  Inner2 w0.3: v1(8.75,24.88) 8.75,22.96 v1(10.54,21.17)
$1N48202: length 5.7
  Top Layer w0.4: R25.1 10.69,23.06 10.88,22.88 12.36,22.88 12.49,22.75 12.49,20.68 12.09,20.28 U6.6
$1N48204: length 1
  Top Layer w0.3: 9.75,23.19 CHRG1.2
$1N52678: length 26.3
  Top Layer w0.3: R20.1 11.03,10.4 11.15,10.4 11.35,10.2 11.35,9.93 11.7,9.59 v1(12.12,9.59) ; Q1.1 15.08,9.01 15.08,9.4 15.55,9.87 15.55,11.83 13.99,13.39 v1(13.99,13.61) ; 15.33,8.76 15.26,8.7 ; R29.2 10.93,19 v1(10.26,18.32) 9.76,17.83 9.26,17.83 9.14,17.95 9.01,17.95 ; v1(12.23,15.32) 10.75,15.32 R19.2
  Inner2 w0.3: v1(10.26,18.32) 10.91,18.32 12.38,16.86 12.38,15.46 v1(12.23,15.32)
  Bottom Layer w0.3: v1(12.23,15.32) 13.94,13.61 v1(13.99,13.61) 13.98,13.61 13.98,10.5 13.13,9.64 12.18,9.64 v1(12.12,9.59) 11.34,10.38 10.25,10.38
$1N67133: length 0.9
  Top Layer w0.3: R26.2 STDBY1.1
$1N67173: length 1.3
  Top Layer w0.3: STDBY.1 9.12,11.81 R23.2
$1N67180: length 0.9
  Top Layer w2: 12.85,17 11.9,17
$1N86456: length 8.1
  Top Layer w0.3: v1(6.25,21.5) 4.29,23.46 SW1.3 ; R29.1 9.62,19.12 9.38,18.88 9.25,18.88
  Bottom Layer w0.3: v1(9.36,18.77) 8.98,18.77 v1(6.25,21.5)
$1N88956: length 0.9
  Top Layer w0.25: R7.1 62.75,26.58 U1.5
$1N88998: length 0.8
  Top Layer w0.25: U1.6 61.82,26.15 61.82,26.64 R8.2
$1N89483: length 0.8
  Top Layer w0.25: U2.6 55.57,26.15 55.57,26.64 R11.2
$1N89485: length 0.9
  Top Layer w0.25: U2.5 56.5,26.58 R10.1
$1N89803: length 0.8
  Top Layer w0.25: R14.2 49.32,26.64 49.32,26.15 U3.6
$1N89805: length 0.9
  Top Layer w0.25: U3.5 50.25,26.58 R13.1
$1N90123: length 0.8
  Top Layer w0.25: R17.2 43.07,26.64 43.07,26.15 U4.6
$1N90125: length 0.9
  Top Layer w0.25: U4.5 44,26.58 R16.1
$1N90197: length 0.7
  Top Layer w0.25: U1.7 R9.2
$1N90243: length 0.7
  Top Layer w0.25: U2.7 R12.2
$1N90285: length 0.7
  Top Layer w0.25: U3.7 R15.2
$1N90327: length 0.7
  Top Layer w0.25: U4.7 R18.2

## Copper pours and planes (outline as drawn; the poured copper is in the pictures)
5V on Top Layer: 44.12,11.29 47.12,11.29 47.12,9.12 44.12,9.12
5V on Inner2: -0.5,14.75 65.5,14.75 65.5,-0.5 -0.5,-0.5
GND on Top Layer: -0.5,30.5 65.5,30.5 65.5,-0.5 -0.5,-0.5
GND on Bottom Layer: -0.5,30.5 65.5,30.5 65.5,-0.5 -0.5,-0.5
GND on Inner1: 63.5,16.28 64.64,16.28 64.64,15.39 63.5,15.39
GND on Inner1: 62.61,17.42 63.5,17.42 63.5,16.28 62.61,16.28
GND on Inner1: 0.15,29.85 64.85,29.85 64.85,0.15 0.15,0.15
V_MOTOR on Top Layer: 58,24.89 60.5,24.89 60.5,22.51 58,22.51
V_MOTOR on Top Layer: 39.25,24.89 41.75,24.89 41.75,22.51 39.25,22.51
V_MOTOR on Top Layer: 51.75,24.89 54.25,24.89 54.25,22.51 51.75,22.51
V_MOTOR on Top Layer: 45.5,24.89 48,24.89 48,22.51 45.5,22.51
V_MOTOR on Inner2: -0.5,30.5 65.5,30.5 65.5,15.25 -0.5,15.25

Small or netless copper shapes (teardrops, artwork), in the pictures only: 12 on Inner1

## Text on the board
Bottom Silkscreen Layer: GATE | VM | 1v8 | B+ | I²C / ADR: / 0x14 / 0x68 | 5V IN | Motor 4 | Motor 3 | Motor 2 | Motor 1 | ON | OFF | Eli Ferrara '26 | Falcon Flight
Top Silkscreen Layer: - / + | 200mA Charging / JST PH 2.0mm / 3.7v 1S1P LiPo (Each) / [MIT] Rev. # 6.1 / Designed by Eli Ferrara - Class of '26 | Motor Battery | SCL SDA IO4 | 3V3 5V GND | Pi Battery | Tested: ☐ / Year:
